# EAGLE design KGGR_wD (EAGLE 9.3.1)

## Sheet 1 of 2
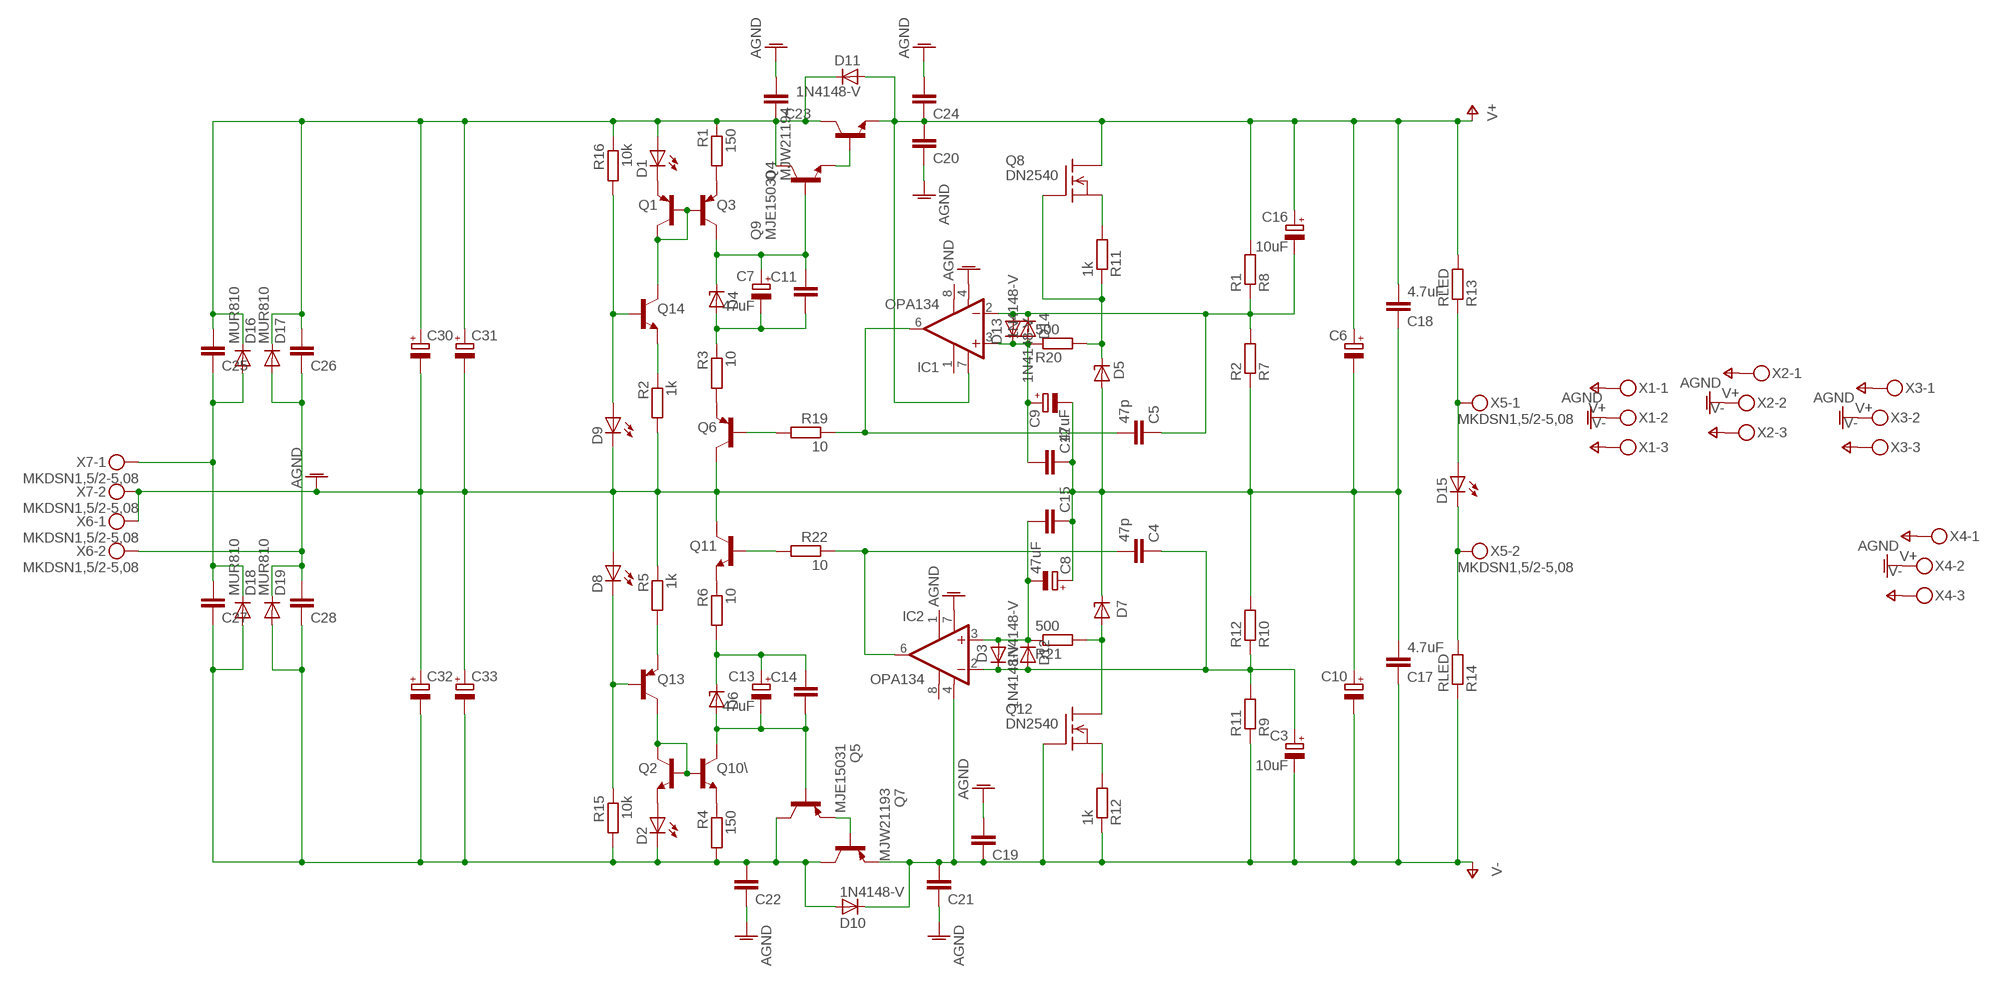
[diagram p0: schematic, sheet 1]

### Parts
C3  10uF  CPOL-EUE5-8.5  [E5-8,5]
C4  47p  C-EU025_050-025X075  [C025_050-025X075]
C5  47p  C-EU025_050-025X075  [C025_050-025X075]
C6  CPOL-EUE7.5-18  [E7,5-18]
C7  47uF  CPOL-EUE5-8.5  [E5-8,5]
C8  47uF  CPOL-EUE5-8.5  [E5-8,5]
C9  47uF  CPOL-EUE5-8.5  [E5-8,5]
C10  CPOL-EUE7.5-18  [E7,5-18]
C11  C-EU050-035X075  [C050-035X075]
C12  C-EU050-035X075  [C050-035X075]
C13  47uF  CPOL-EUE5-8.5  [E5-8,5]
C14  C-EU050-035X075  [C050-035X075]
C15  C-EU050-035X075  [C050-035X075]
C16  10uF  CPOL-EUE5-8.5  [E5-8,5]
C17  4.7uF  C-EU050-075X075  [C050-075X075]
C18  4.7uF  C-EU050-075X075  [C050-075X075]
C19  C-EU050-035X075  [C050-035X075]
C20  C-EU050-035X075  [C050-035X075]
C21  C-EU050-035X075  [C050-035X075]
C22  C-EU050-075X075  [C050-075X075]
C23  C-EU050-075X075  [C050-075X075]
C24  C-EU050-035X075  [C050-035X075]
C25  C-EU050-035X075  [C050-035X075]
C26  C-EU050-035X075  [C050-035X075]
C27  C-EU050-035X075  [C050-035X075]
C28  C-EU050-035X075  [C050-035X075]
C30  CPOL-EUE7.5-18  [E7,5-18]
C31  CPOL-EUE7.5-18  [E7,5-18]
C32  CPOL-EUE7.5-18  [E7,5-18]
C33  CPOL-EUE7.5-18  [E7,5-18]
D1  LED5MM  [LED5MM]
D2  LED5MM  [LED5MM]
D3  1N4148-V  [1N4148]
D4  1N4728  [DO41Z10]
D5  LT1021  LT1021-V  [DIL08]
D6  1N4728  [DO41Z10]
D7  LT1021  LT1021-V  [DIL08]
D8  LED5MM  [LED5MM]
D9  LED5MM  [LED5MM]
D10  1N4148-V  [1N4148]
D11  1N4148-V  [1N4148]
D12  1N4148-V  [1N4148]
D13  1N4148-V  [1N4148]
D14  1N4148-V  [1N4148]
D15  LED5MM  [LED5MM]
D16  MUR810  [TO220ACS]
D17  MUR810  [TO220ACS]
D18  MUR810  [TO220ACS]
D19  MUR810  [TO220ACS]
IC1  OPA134  OPA134P  [DIL08]
IC2  OPA134  OPA134P  [DIL08]
Q1  MPSA92-PNP-TO92-EBC  [TO92-EBC]
Q2  MPSA42-NPN-TO92-EBC  [TO92-EBC]
Q3  MPSA92-PNP-TO92-EBC  [TO92-EBC]
Q4  MJW21194  MJL4281  [TO-264]
Q5  MJE15031  [TO220KG]
Q6  MPSA92-PNP-TO92-EBC  [TO92-EBC]
Q7  MJW21193  MJL4302  [TO-264]
Q8  DN2540  2N7000  [TO92-]
Q9  MJE15030  [TO220KG]
Q10\  MPSA42-NPN-TO92-EBC  [TO92-EBC]
Q11  MPSA42-NPN-TO92-EBC  [TO92-EBC]
Q12  DN2540  2N7000  [TO92-]
Q13  MPSA92-PNP-TO92-EBC  [TO92-EBC]
Q14  MPSA42-NPN-TO92-EBC  [TO92-EBC]
R1  150  R-EU_0309/12  [0309/12]
R2  1k  R-EU_0309/12  [0309/12]
R3  10  R-EU_0309/12  [0309/12]
R4  150  R-EU_0309/12  [0309/12]
R5  1k  R-EU_0309/12  [0309/12]
R6  10  R-EU_0309/12  [0309/12]
R7  R2  R-EU_0309/12  [0309/12]
R8  R1  R-EU_0309/12  [0309/12]
R9  R11  R-EU_0309/12  [0309/12]
R10  R12  R-EU_0309/12  [0309/12]
R11  1k  R-EU_0309/12  [0309/12]
R12  1k  R-EU_0309/12  [0309/12]
R13  RLED  R-EU_0309/12  [0309/12]
R14  RLED  R-EU_0309/12  [0309/12]
R15  10k  R-EU_0309/12  [0309/12]
R16  10k  R-EU_0309/12  [0309/12]
R19  10  R-EU_0309/12  [0309/12]
R20  500  R-EU_0309/12  [0309/12]
R21  500  R-EU_0309/12  [0309/12]
R22  10  R-EU_0309/12  [0309/12]
X1  MKDSN1,5/3-5,08  [MKDSN1,5/3-5,08]
X2  MKDSN1,5/3-5,08  [MKDSN1,5/3-5,08]
X3  MKDSN1,5/3-5,08  [MKDSN1,5/3-5,08]
X4  MKDSN1,5/3-5,08  [MKDSN1,5/3-5,08]
X5  MKDSN1,5/2-5,08  [MKDSN1,5/2-5,08]
X6  MKDSN1,5/2-5,08  [MKDSN1,5/2-5,08]
X7  MKDSN1,5/2-5,08  [MKDSN1,5/2-5,08]

### Nets
AGND: C6.- C8.+ C9.- C10.+ C12.1 C15.1 C17.2 C18.1 C19.2 C20.1 C21.1 C22.1 C23.2 C24.2 C30.- C31.- C32.+ C33.+ D5.4(GND) D7.6(OUT) D8.A D9.K(C) IC1.4(V-) IC2.7(V+) Q6.C Q11.C R2.2 R5.1 R7.1 R10.2 X1.2 X2.2 X3.2 X4.2 X6.1 X7.2
N$1: Q1.B Q1.C Q3.B Q14.C
N$2: D1.K(C) Q1.E
N$3: Q3.E R1.2
N$4: C23.1 C25.2 C26.2 C30.+ C31.+ D1.A D11.C D16.C D17.C Q4.C Q9.2(C) R1.1 R16.1
N$5: C7.+ C11.1 D4.C Q3.C Q9.1(B)
N$6: C7.- C11.2 D4.A R3.1
N$7: Q6.E R3.2
N$8: Q14.E R2.1
N$9: D9.A Q14.B R16.2
N$10: C8.- C15.2 D3.A D12.C IC2.3(+IN) R21.1
N$11: Q13.E R5.2
N$12: D8.K(C) Q13.B R15.1
N$13: Q11.E R6.1
N$14: C13.+ C14.1 D6.C R6.2
N$15: C13.- C14.2 D6.A Q5.1(B) Q10\.C
N$16: Q2.B Q2.C Q10\.B Q13.C
N$17: Q5.3(E) Q7.B
N$18: Q10\.E R4.1
N$19: D2.A Q2.E
N$21: Q4.B Q9.3(E)
N$22: C22.2 C27.1 C28.1 C32.- C33.- D2.K(C) D10.A D18.A D19.A Q5.2(C) Q7.C R4.2 R15.2
N$23: C25.1 C27.2 D16.A D18.C X7.1
N$24: C5.2 C5.3 IC1.6(OUT) R19.1
N$25: C4.2 C4.3 IC2.6(OUT) R22.1
N$26: Q11.B R22.2
N$27: Q6.B R19.2
N$28: C5.1 C16.- D13.A D14.C IC1.2(-IN) R7.2 R8.1
N$29: Q12.3(S) R12.2
N$30: D5.6(OUT) Q8.2(G) R11.1 R20.2
N$31: C9.+ C12.2 D13.C D14.A IC1.3(+IN) R20.1
N$32: D15.K(C) R14.2 X5.2
N$33: D7.4(GND) Q12.1(D) R21.2
N$34: C3.+ C4.1 D3.C D12.A IC2.2(-IN) R9.2 R10.1
N$35: Q8.3(S) R11.2
N$36: D15.A R13.1 X5.1
N$38: C26.1 C28.2 D17.A D19.C X6.2
V+: C6.+ C16.+ C18.2 C20.2 C24.1 D11.A IC1.7(V+) Q4.E Q8.1(D) R8.2 R13.2 X1.1 X2.1 X3.1 X4.1
V-: C3.- C10.- C17.1 C19.1 C21.2 D10.C IC2.4(V-) Q7.E Q12.2(G) R9.1 R12.1 R14.1 X1.3 X2.3 X3.3 X4.3
Unconnected: IC1.1(TRIM1) IC1.8(TRIM2) IC2.1(TRIM1) IC2.8(TRIM2)

## Sheet 2 of 2
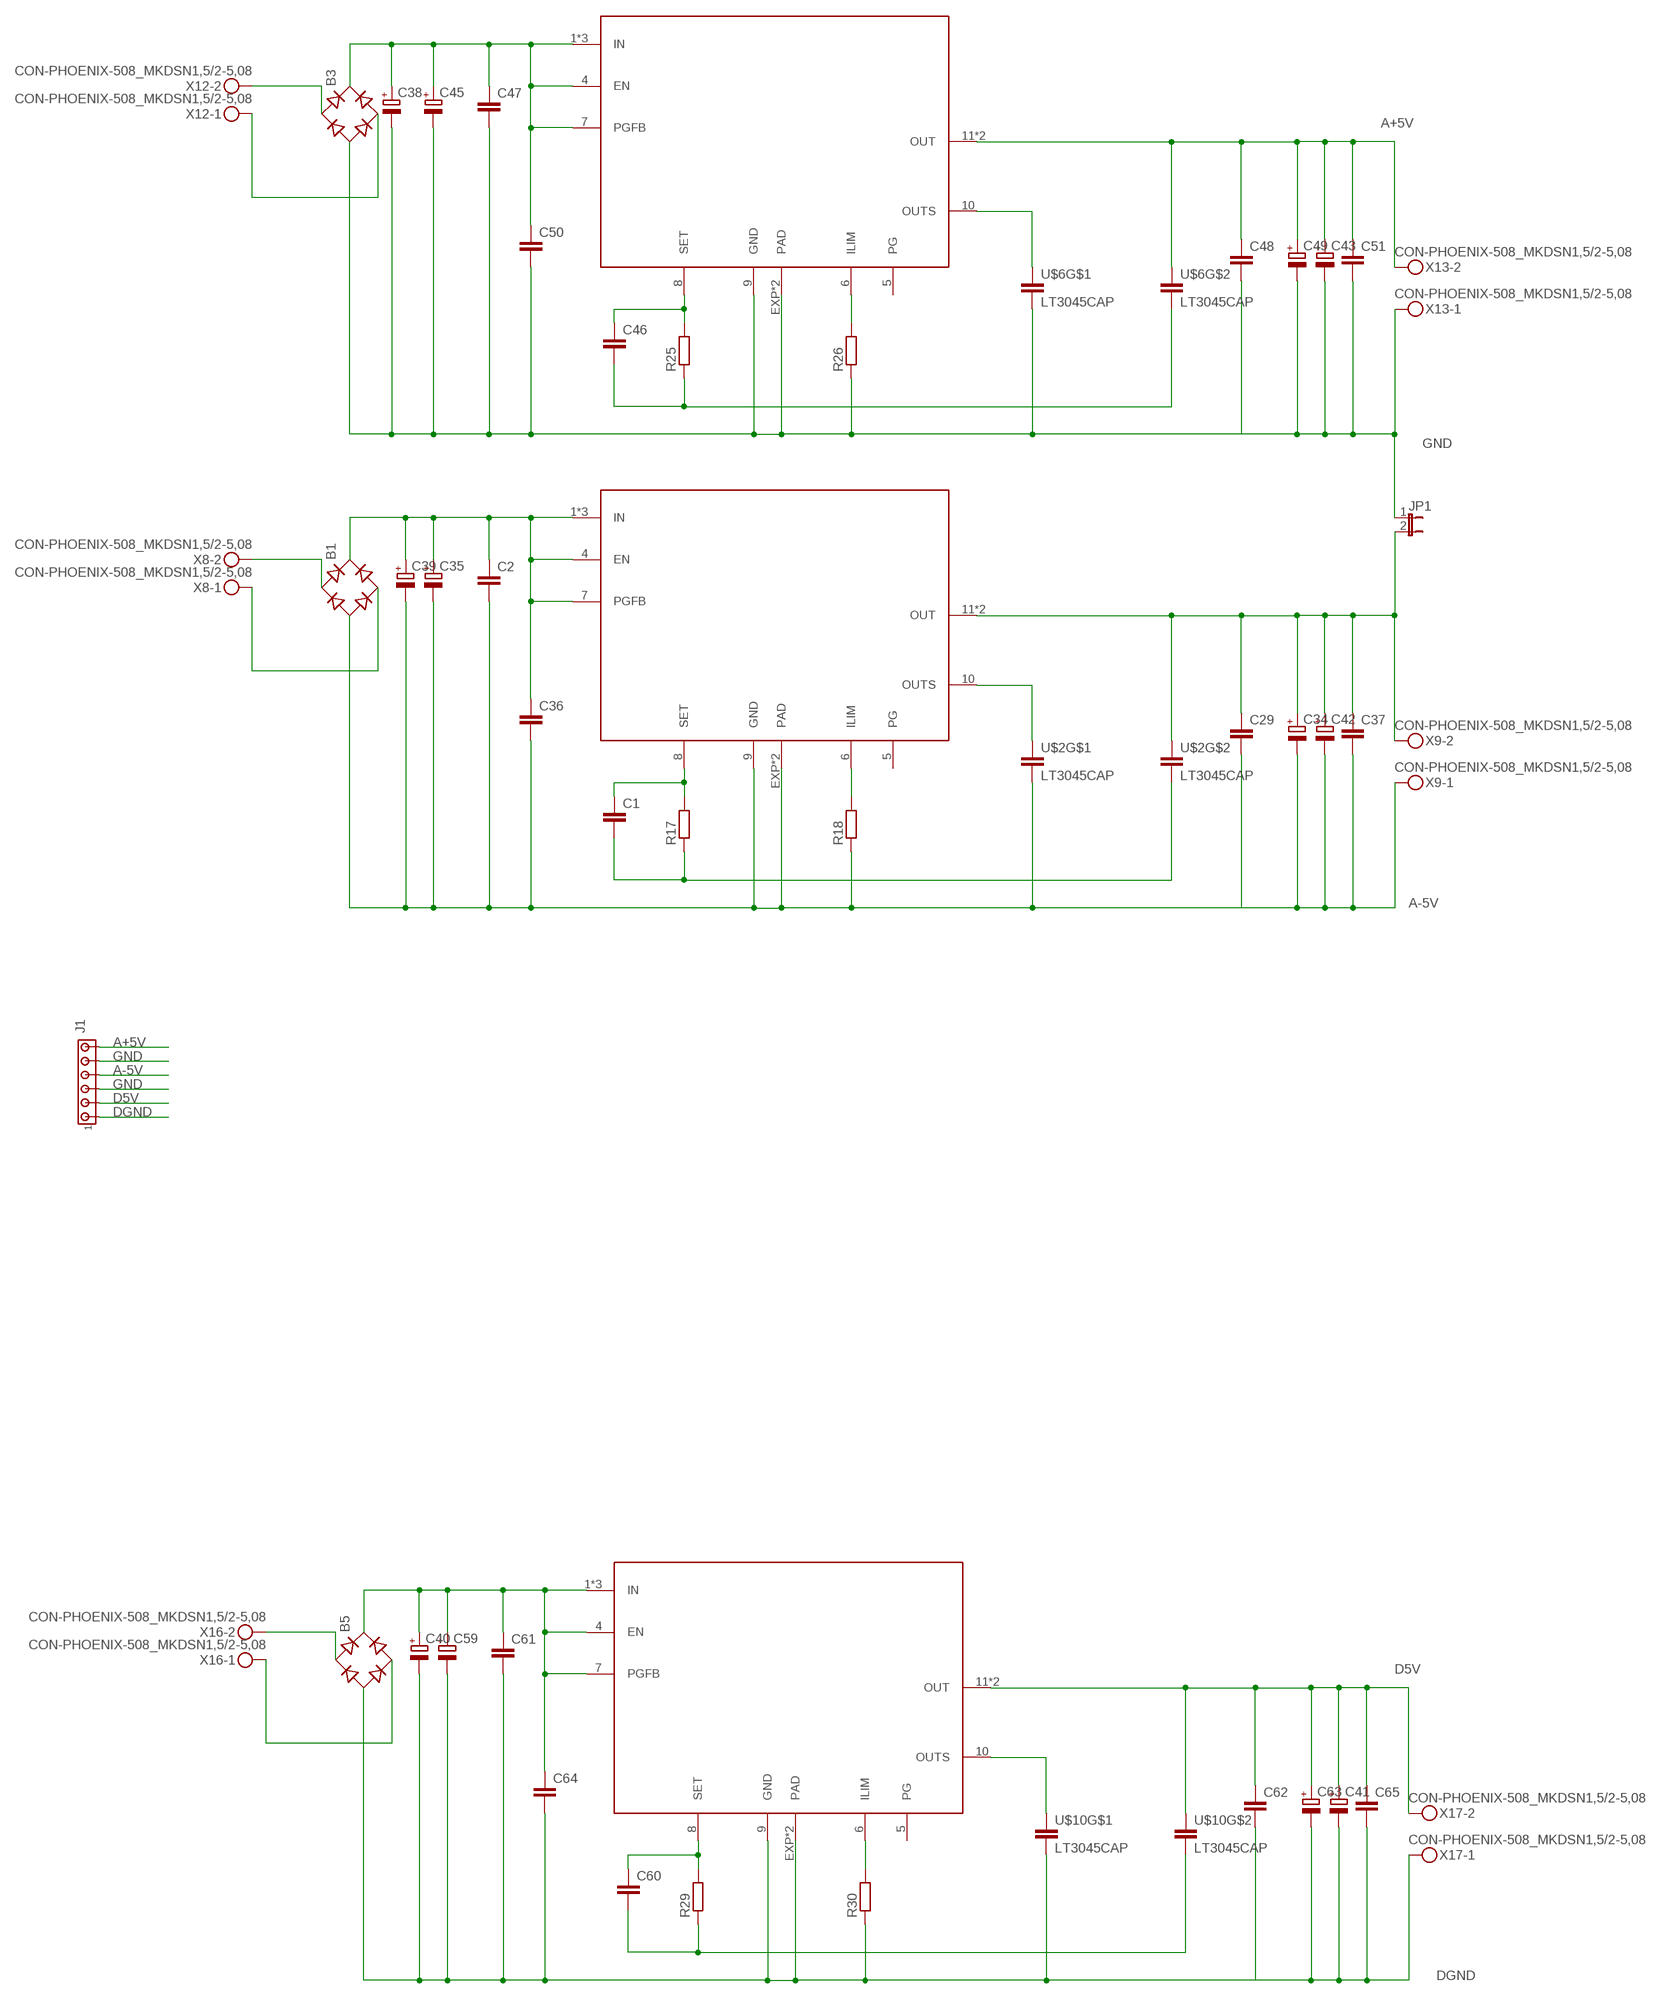
[diagram p1: schematic, sheet 2]

### Parts
B1  RB1A  [RB1A]
B3  RB1A  [RB1A]
B5  RB1A  [RB1A]
C1  C-EUC1206  [C1206]
C2  C-EU050-050X075  [C050-050X075]
C29  C-EU050-050X075  [C050-050X075]
C34  CPOL-EUE5-10.5  [E5-10,5]
C35  CPOL-EUE7.5-18  [E7,5-18]
C36  C-EUC1206  [C1206]
C37  C-EUC1206  [C1206]
C38  CPOL-EUSP-CAP-CX  [SP-CAP-CX]
C39  CPOL-EUSP-CAP-CX  [SP-CAP-CX]
C40  CPOL-EUSP-CAP-CX  [SP-CAP-CX]
C41  CPOL-EUSP-CAP-CX  [SP-CAP-CX]
C42  CPOL-EUSP-CAP-CX  [SP-CAP-CX]
C43  CPOL-EUSP-CAP-CX  [SP-CAP-CX]
C45  CPOL-EUE7.5-18  [E7,5-18]
C46  C-EUC1206  [C1206]
C47  C-EU050-050X075  [C050-050X075]
C48  C-EU050-050X075  [C050-050X075]
C49  CPOL-EUE5-10.5  [E5-10,5]
C50  C-EUC1206  [C1206]
C51  C-EUC1206  [C1206]
C59  CPOL-EUE7.5-18  [E7,5-18]
C60  C-EUC1206  [C1206]
C61  C-EU050-050X075  [C050-050X075]
C62  C-EU050-050X075  [C050-050X075]
C63  CPOL-EUE5-10.5  [E5-10,5]
C64  C-EUC1206  [C1206]
C65  C-EUC1206  [C1206]
J1  MTA06-156  [1X6MTA]
JP1  JP1E  [JP1]
R17  R-EU_MELF0204R  [MINI_MELF-0204R]
R18  R-EU_MELF0204R  [MINI_MELF-0204R]
R25  R-EU_MELF0204R  [MINI_MELF-0204R]
R26  R-EU_MELF0204R  [MINI_MELF-0204R]
R29  R-EU_MELF0204R  [MINI_MELF-0204R]
R30  R-EU_MELF0204R  [MINI_MELF-0204R]
U$1  LT3045  [MSOP12]
U$2  LT3045CAP  [LT3045CAP]
U$5  LT3045  [MSOP12]
U$6  LT3045CAP  [LT3045CAP]
U$9  LT3045  [MSOP12]
U$10  LT3045CAP  [LT3045CAP]
X8  CON-PHOENIX-508_MKDSN1,5/2-5,08  [CON-PHOENIX-508_MKDSN1,5/2-5,08]
X9  CON-PHOENIX-508_MKDSN1,5/2-5,08  [CON-PHOENIX-508_MKDSN1,5/2-5,08]
X12  CON-PHOENIX-508_MKDSN1,5/2-5,08  [CON-PHOENIX-508_MKDSN1,5/2-5,08]
X13  CON-PHOENIX-508_MKDSN1,5/2-5,08  [CON-PHOENIX-508_MKDSN1,5/2-5,08]
X16  CON-PHOENIX-508_MKDSN1,5/2-5,08  [CON-PHOENIX-508_MKDSN1,5/2-5,08]
X17  CON-PHOENIX-508_MKDSN1,5/2-5,08  [CON-PHOENIX-508_MKDSN1,5/2-5,08]

### Nets
A+5V: C43.+ C48.1 C49.+ C51.1 J1.6 U$5.11(OUT) U$5.12(OUT) U$6.4 X13.2
A-5V: B1.- C2.2 C29.2 C34.- C35.- C36.2 C37.2 C39.- C42.- J1.4 R18.1 U$1.9(GND) U$1.EXP1(PAD) U$1.EXP(PAD) U$2.5 X9.1
D5V: C41.+ C62.1 C63.+ C65.1 J1.2 U$9.11(OUT) U$9.12(OUT) U$10.4 X17.2
DGND: B5.- C40.- C41.- C59.- C61.2 C62.2 C63.- C64.2 C65.2 J1.1 R30.1 U$9.9(GND) U$9.EXP1(PAD) U$9.EXP(PAD) U$10.5 X17.1
GND: B3.- C38.- C43.- C45.- C47.2 C48.2 C49.- C50.2 C51.2 J1.3 J1.5 JP1.1 R26.1 U$5.9(GND) U$5.EXP1(PAD) U$5.EXP(PAD) U$6.5 X13.1
IN1: B1.+ C2.1 C35.+ C36.1 C39.+ U$1.1(IN) U$1.2(IN) U$1.3(IN) U$1.4(EN) U$1.7(PGFB)
IN2: B3.+ C38.+ C45.+ C47.1 C50.1 U$5.1(IN) U$5.2(IN) U$5.3(IN) U$5.4(EN) U$5.7(PGFB)
IN3: B5.+ C40.+ C59.+ C61.1 C64.1 U$9.1(IN) U$9.2(IN) U$9.3(IN) U$9.4(EN) U$9.7(PGFB)
N$44: U$1.10(OUTS) U$2.3
N$46: U$5.10(OUTS) U$6.3
N$47: R18.2 U$1.6(ILIM)
N$48: B1.AC2 X8.1
N$49: B1.AC1 X8.2
N$50: R26.2 U$5.6(ILIM)
N$51: B3.AC2 X12.1
N$52: B3.AC1 X12.2
N$57: U$9.10(OUTS) U$10.3
N$58: R30.2 U$9.6(ILIM)
N$59: B5.AC2 X16.1
N$60: B5.AC1 X16.2
OUT1: C29.1 C34.+ C37.1 C42.+ JP1.2 U$1.11(OUT) U$1.12(OUT) U$2.4 X9.2
SET1: C1.1 R17.2 U$1.8(SET)
SET2: C46.1 R25.2 U$5.8(SET)
SET3: C60.1 R29.2 U$9.8(SET)
SGND1: C1.2 R17.1 U$2.6
SGND2: C46.2 R25.1 U$6.6
SGND3: C60.2 R29.1 U$10.6
Unconnected: U$1.5(PG) U$5.5(PG) U$9.5(PG)

## Library data of the parts
B1 B3 B5 = rectifier:RB1A: RECTIFIER 1 A
C1 C2 C4 C5 C11 C12 C14 C15 C17-C29 C36 C37 C46-C48 C50 C51 C60-C62 C64 C65 = Vwvwbg:C-EU: CAPACITOR, European symbol
C3 C6-C10 C13 C16 C30-C35 C38-C43 C45 C49 C59 C63 = Vwvwbg:CPOL-EU: POLARIZED CAPACITOR, European symbol
D1 D2 D8 D9 D15 = led:LED: LED OSRAM: - CHIPLED LG R971, LG N971, LY N971, LG Q971, LY Q971, LO R971, LY R971 LH N974, LH R974 LS Q976, LO Q976, LY Q976 LO Q996 - Hyper CHIPLED LW Q18S LB Q993, LB Q99A, LB R99A - SideLED LS A670, LO A670, LY A670, LG A670, LP A670 LB A673, LV A673, LT A673, LW A673 LH A674 LY A675 LS A676, LA A676, LO A676, LY A676, LW A676 LS A679, LY A679, LG A679 - Hyper Micro SIDELED® LS Y876, LA Y876, LO Y876, LY Y876 LT Y87S - SmartLED LW L88C, LW L88S LB L89C, LB L89S, LG L890 LS L89K, LO L89K, LY L89K LS L896, LA L896, LO L896, LY L896 - TOPLED LS T670, LO T670, LY T670, LG T670, LP T670 LSG T670, LSP T670, LSY T670, LOP T670, LYG T670 LG T671, LOG T671, LSG T671 LB T673, LV T673, LT T673, LW T673 LH T674 LS T676, LA T676, LO T676, LY T676, LB T676, LH T676, LSB T676, LW T676 LB T67C, LV T67C, LT T67C, LS T67K, LO T67K, LY T67K, LW E67C LS E67B, LA E67B, LO E67B, LY E67B, LB E67C, LV E67C, LT E67C LW T67C LS T679, LY T679, LG T679 LS T770, LO T770, LY T770, LG T770, LP T770 LB T773, LV T773, LT T773, LW T773 LH T774 LS E675, LA E675, LY E675, LS T675 LS T776, LA T776, LO T776, LY T776, LB T776 LHGB T686 LT T68C, LB T68C - Hyper Mini TOPLED® LB M676 - Mini TOPLED Santana® LG M470 LS M47K, LO M47K, LY M47K Source: http://www.osram.convergy.de LUXEON: - LUMILED® LXK2-PW12-R00, LXK2-PW12-S00, LXK2-PW14-U00, LXK2-PW14-V00 LXK2-PM12-R00, LXK2-PM12-S00, LXK2-PM14-U00 LXK2-PE12-Q00, LXK2-PE12-R00, LXK2-PE12-S00, LXK2-PE14-T00, LXK2-PE14-U00 LXK2-PB12-K00, LXK2-PB12-L00, LXK2-PB12-M00, LXK2-PB14-N00, LXK2-PB14-P00, LXK2-PB14-Q00 LXK2-PR12-L00, LXK2-PR12-M00, LXK2-PR14-Q00, LXK2-PR14-R00 LXK2-PD12-Q00, LXK2-PD12-R00, LXK2-PD12-S00 LXK2-PH12-R00, LXK2-PH12-S00 LXK2-PL12-P00, LXK2-PL12-Q00, LXK2-PL12-R00 Source: www.luxeon.com KINGBRIGHT: KA-3528ASYC Source: www.kingbright.com
D3 D10-D14 = diode:1N4148-V
D4 D6 = diode:1N4728: Z DIODE 3.3 V, 1W, 5 percent
D5 D7 = linear-technology:LT1021-V
D16-D19 = diode:MUR810: DIODE
IC1 IC2 = burr-brown:OPA134: Operational Amplifiers SoundPlus(TM) High Performance Audio; MF: TEXAS INSTRUMENTS; MPN: OPA134PA; OC_FARNELL: 1335032; OC_NEWARK: 75C4599
J1 = con-amp:MTA06-156: AMP connector
JP1 = jumper:JP1E: JUMPER
Q1 Q3 Q6 Q13 = transistor:*-PNP-: PNP Transistror
Q2 Q10\ Q11 Q14 = transistor:*-NPN-: NPN Transistror BF959 corrected 2008.03.06
Q4 = TO264:MJL4281: MJL4281 NPN BCE TO-264
Q5 = transistor:MJE15031
Q7 = TO264:MJL4302: MJL4302 PNP BCE TO-264
Q8 Q12 = tranzistory FET:2N7000
Q9 = transistor:MJE15030
R1-R22 R25 R26 R29 R30 = Vwvwbg:R-EU_: RESISTOR, European symbol
U$1 U$5 U$9 = Vwvwbg:LT3045
U$2 U$6 U$10 = Vwvwbg:LT3045CAP
X1-X4 = con-phoenix-508:MKDSN1,5/3-5,08: MKDSN 1,5/ 3-5,08 Printklemme Nennstrom: 13,5 A Nennspannung: 250 V Rastermaß: 5,08 mm Polzahl: 3 Anschlussart: Schraubanschluss Montage: Löten Anschlussrichtung Leiter/Platine: 0 ° Artikelnummer: 1729131 Source: http://eshop.phoenixcontact.com .. 1729131.pdf
X5-X7 = con-phoenix-508:MKDSN1,5/2-5,08: MKDSN 1,5/ 2-5,08 Printklemme Nennstrom: 13,5 A Nennspannung: 250 V Rastermaß: 5,08 mm Polzahl: 2 Anschlussart: Schraubanschluss Montage: Löten Anschlussrichtung Leiter/Platine: 0 ° Artikelnummer: 1729128 Source: http://eshop.phoenixcontact.com .. 1729128.pdf
X8 X9 X12 X13 X16 X17 = Vwvwbg:CON-PHOENIX-508_MKDSN1,5/2-5,08: MKDSN 1,5/ 2-5,08 Printklemme Nennstrom: 13,5 A Nennspannung: 250 V Rastermaß: 5,08 mm Polzahl: 2 Anschlussart: Schraubanschluss Montage: Löten Anschlussrichtung Leiter/Platine: 0 ° Artikelnummer: 1729128 Source: http://eshop.phoenixcontact.com .. 1729128.pdf

## Board
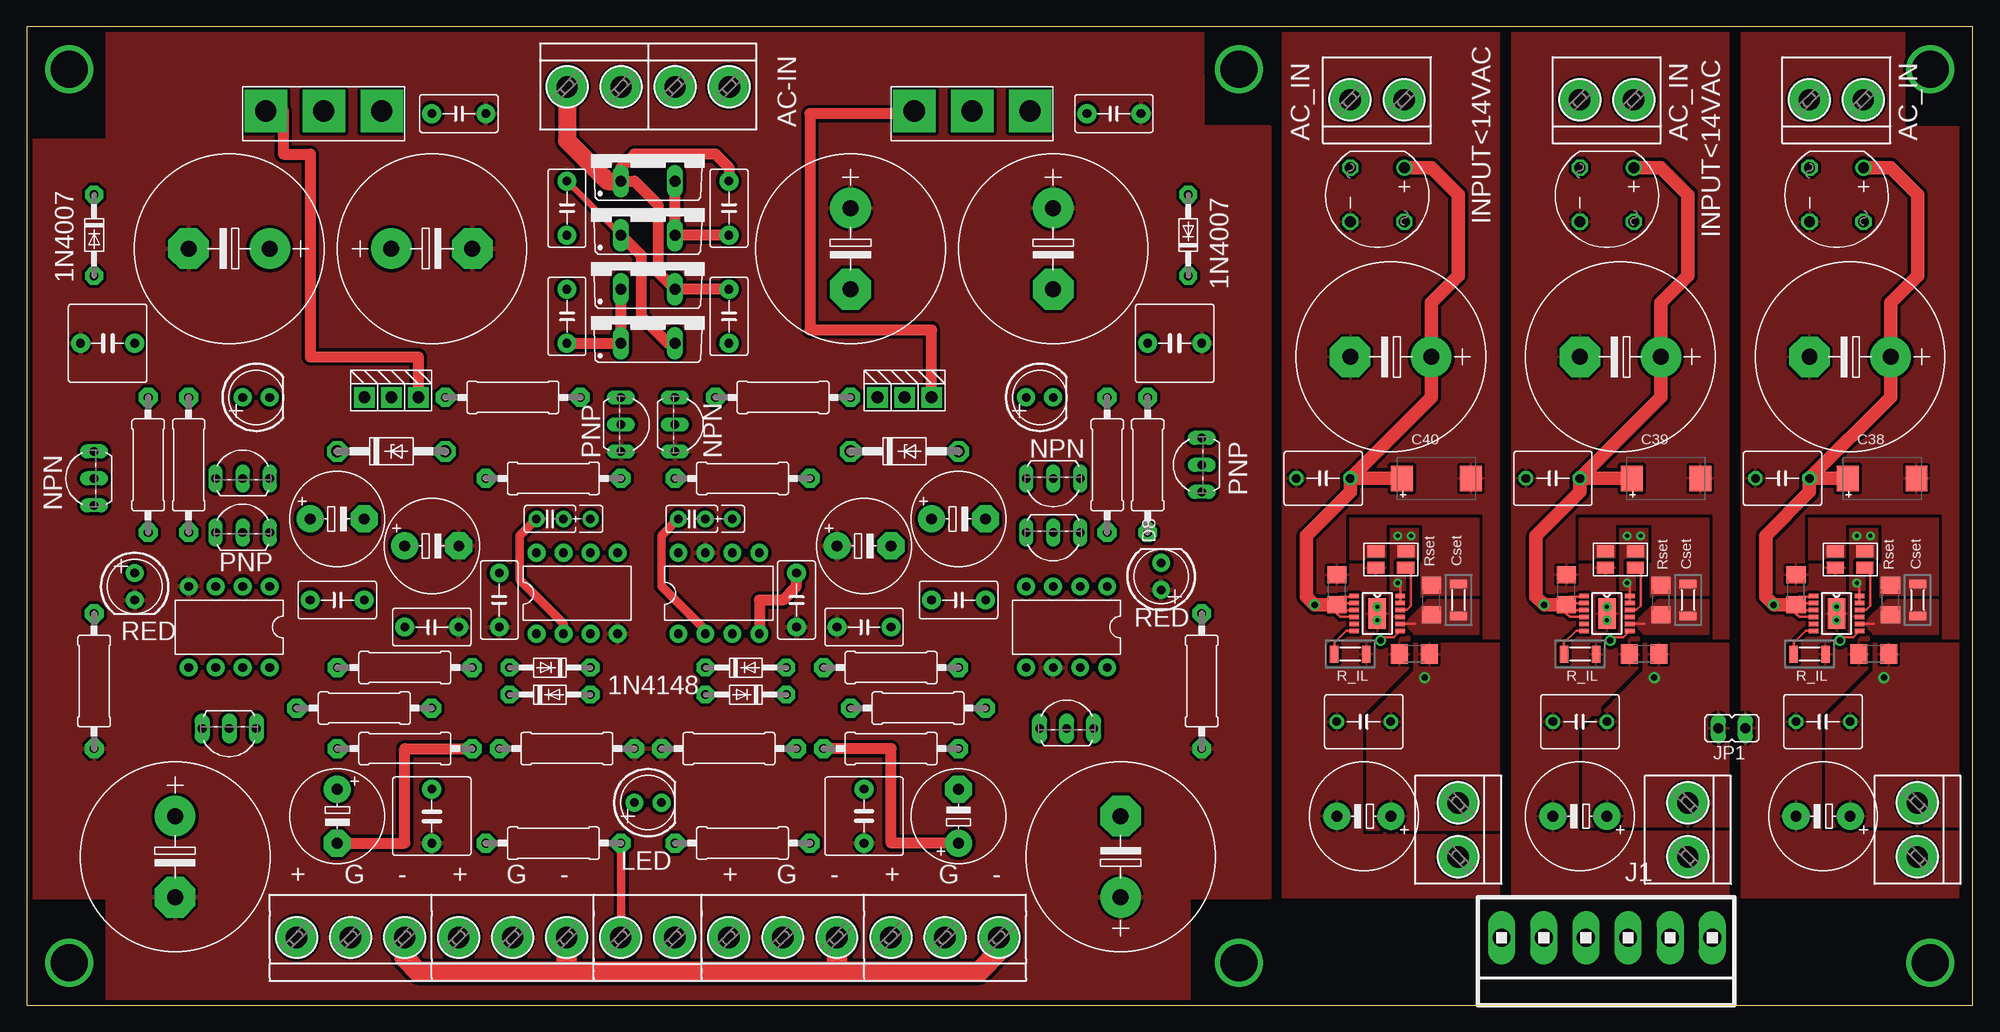
[diagram p2: board, top side]
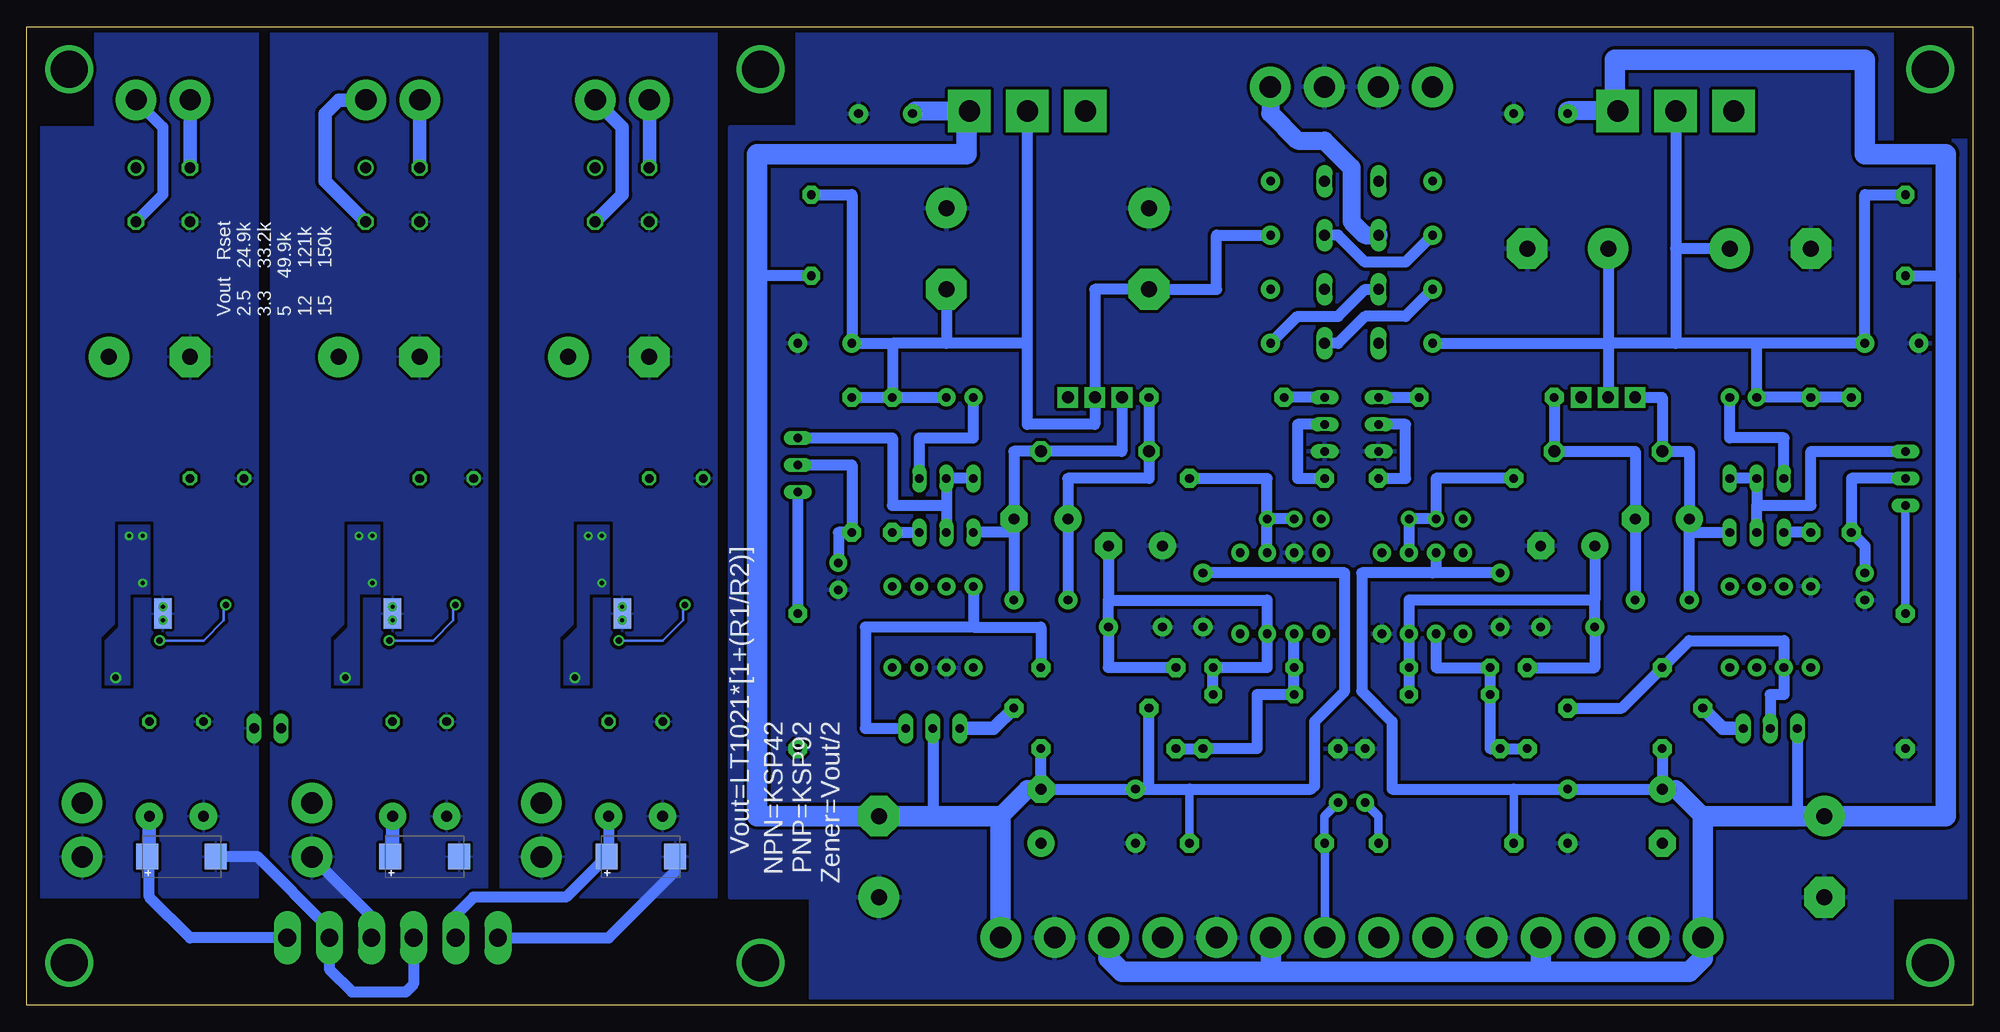
[diagram p3: board, bottom side, seen from below]

Size 183 x 92 mm. Coordinates in mm from the lower left corner, seen from the top.
Outline: 0,0 183,0 183,92 0,92 0,0
Copper layers (1*16): Top 0.035mm / dielectric 1.5mm / Bottom 0.035mm
Design rules "default *": minimum track width 10mil, minimum drill 24mil, track to track 12mil, track to pad 12mil, pad to pad 8mil, via to via 8mil, smd to smd 8mil, copper to edge 20mil, drill to drill 8mil, minimum pad ring 10mil, minimum via ring 8mil, stop-mask expansion 4mil, vias tented up to drill 0mil, thermal gap 10mil

### Footprints (pad centres in the part's own frame; a part is rotated, then mirrored left to right if it is on the bottom)
RB1A = drill 1.016: + -2.54,2.54 | drill 1.016 octagon: - 2.54,-2.54; AC1 2.54,2.54; AC2 -2.54,-2.54
C1206 = smd 1.6 x 1.8: 1 -1.4,0; 2 1.4,0
C050-050X075 = drill 0.813 octagon: 1 -2.54,0; 2 2.54,0
E5-8,5 = drill 1.016 pad 2.54: + -2.54,0 | drill 1.016 pad 2.54 octagon: - 2.54,0
C025_050-025X075 = drill 0.813 pad 1.524: 1 -1.27,0; 2 1.27,0; 3 3.81,0
E7,5-18 = drill 1.5 pad 3.81: + -3.81,0 | drill 1.5 pad 3.81 octagon: - 3.81,0
C050-035X075 = drill 0.813 pad 1.778: 1 -2.54,0; 2 2.54,0
C050-075X075 = drill 0.813 pad 1.778: 1 -2.54,0; 2 2.54,0
E5-10,5 = drill 1.016 pad 2.54: + -2.54,0; - 2.54,0
SP-CAP-CX = smd 2.062 x 2.4: + -2.754,0; - 3.707,0
LED5MM = drill 0.813 pad 1.676: A -1.27,0; K 1.27,0
1N4148 = drill 0.813 pad 1.676 octagon: A 3.81,0; C -3.81,0
DO41Z10 = drill 1.118 pad 1.93 octagon: A 5.08,0; C -5.08,0
DIL08 = drill 0.813 pad 1.676: 1 -3.81,-3.81; 2 -1.27,-3.81; 3 1.27,-3.81; 4 3.81,-3.81; 5 3.81,3.81; 6 1.27,3.81; 7 -1.27,3.81; 8 -3.81,3.81
TO220ACS = drill 1.016 long: A 2.54,-2.54; C -2.54,-2.54
1X6MTA = drill 1.676 long: 1 9.906,0; 2 5.944,0; 3 1.981,0; 4 -1.981,0; 5 -5.944,0; 6 -9.906,0
JP1 = drill 0.914 long: 1 0,-1.27; 2 0,1.27
TO92-EBC = drill 0.813 long: B 0,-1.27; C 2.54,-1.27; E -2.54,-1.27
TO-264 = drill 2 pad 4 square: B -5.45,-6.096; C 0,-6.096; E 5.45,-6.096
TO220KG = drill 1.1 pad 1.93 square: 1 -2.54,0; 2 0,0; 3 2.54,0
TO92- = drill 0.813 pad 1.422 long: 1 2.54,0; 2 0,0; 3 -2.54,0
0309/12 = drill 0.813 pad 1.778 octagon: 1 -6.35,0; 2 6.35,0
MINI_MELF-0204R = smd 0.8 x 1.6: 1 -1.5,0; 2 1.5,0
MSOP12 = smd 0.9 x 0.42: 1 -2.163,1.625; 2 -2.163,0.975; 3 -2.163,0.325; 4 -2.163,-0.325; 5 -2.163,-0.975; 6 -2.163,-1.625; 7 2.15,-1.625; 8 2.15,-0.975; 9 2.15,-0.325; 10 2.15,0.325; 11 2.15,0.975; 12 2.15,1.625 | smd 1.65 x 2.85: EXP 0,0 | smd 1.65 x 2.85 bottom: EXP1 0,0
LT3045CAP = smd 1.6 x 1.143: 3 -1.394,0.767; 4 -1.4,-0.776; 5 1.402,0.776; 6 1.403,-0.767
MKDSN1,5/3-5,08 = drill 2 pad 3.81: 1 -7.641,0.025; 2 -2.561,0.025; 3 2.519,0.025
MKDSN1,5/2-5,08 = drill 2 pad 3.81: 1 -2.561,0.025; 2 2.519,0.025
CON-PHOENIX-508_MKDSN1,5/2-5,08 = drill 2 pad 3.81: 1 -2.561,0.025; 2 2.519,0.025

### Placement (x,y rotation side)
B1  148.59,76.2 270 top
B3  170.18,76.2 270 top
B5  127,76.2 270 top
C1  153.67,38.1 90 top
C2  143.51,49.53 180 top
C3  87.63,17.78 90 top
C4  62.55,45.72 0 top
C5  49.21,45.72 0 top
C6  13.97,13.97 270 top
C7  29.21,45.72 0 top
C8  78.74,43.18 0 top
C9  38.1,43.18 0 top
C10  102.87,13.97 90 top
C11  29.21,38.1 0 top
C12  38.1,35.56 180 top
C13  87.63,45.72 0 top
C14  87.63,38.1 0 top
C15  78.74,35.56 0 top
C16  29.21,17.78 270 top
C17  78.74,17.78 270 top
C18  38.1,17.78 90 top
C19  72.39,38.1 270 top
C20  44.45,38.1 90 top
C21  102.23,83.82 180 top
C22  107.95,62.23 180 top
C23  7.62,62.23 180 top
C24  40.64,83.82 0 top
C25  50.8,64.77 270 top
C26  66.04,64.77 270 top
C27  50.8,74.93 90 top
C28  66.04,74.93 90 top
C29  146.05,26.67 180 top
C30  19.05,71.12 180 top
C31  38.1,71.12 0 top
C32  77.47,71.12 270 top
C33  96.52,71.12 270 top
C34  146.05,17.78 180 top
C35  149.86,60.96 180 top
C36  144.78,39.05 90 top
C37  152.08,33.02 180 top
C38  173.99,49.53 0 top
C39  153.67,49.53 0 top
C40  132.08,49.53 0 top
C41  125.73,13.97 0 bottom
C42  146.05,13.97 0 bottom
C43  168.91,13.97 0 bottom
C45  171.45,60.96 180 top
C46  175.26,38.1 90 top
C47  165.1,49.53 180 top
C48  168.91,26.67 180 top
C49  168.91,17.78 180 top
C50  166.37,39.05 90 top
C51  173.67,33.02 180 top
C59  128.27,60.96 180 top
C60  132.08,38.1 90 top
C61  121.92,49.53 180 top
C62  125.73,26.67 180 top
C63  125.73,17.78 180 top
C64  123.19,39.05 90 top
C65  130.49,33.02 180 top
D1  21.59,57.15 0 top
D2  95.25,57.15 0 top
D3  67.63,31.75 0 top
D4  34.29,52.07 0 top
D5  19.05,35.56 180 top
D6  82.55,52.07 0 top
D7  97.79,35.56 180 top
D8  106.68,40.32 90 top
D9  10.16,39.37 270 top
D10  109.22,72.39 90 top
D11  6.35,72.39 270 top
D12  67.63,29.21 180 top
D13  49.21,31.75 180 top
D14  49.21,29.21 0 top
D15  58.42,19.05 0 top
D16  58.42,64.77 0 top
D17  58.42,69.85 0 top
D18  58.42,74.93 0 top
D19  58.42,80.01 0 top
IC1  51.75,38.73 0 top
IC2  65.09,38.73 0 top
J1  148.59,6.35 180 top
JP1  160.34,26.04 90 top
Q1  20.32,50.8 0 top
Q2  96.52,48.26 180 top
Q3  20.32,45.72 0 top
Q4  27.94,90.17 0 top
Q5  82.55,57.15 0 top
Q6  57.15,54.61 270 top
Q7  88.9,90.17 0 top
Q8  19.05,26.04 180 top
Q9  34.29,57.15 0 top
Q10\  96.52,43.18 180 top
Q11  62.23,54.61 270 top
Q12  97.79,26.04 0 top
Q13  109.22,50.8 90 top
Q14  5.08,49.53 90 top
R1  15.24,50.8 270 top
R2  6.35,30.48 270 top
R3  45.72,57.15 0 top
R4  101.6,50.8 90 top
R5  110.49,30.48 90 top
R6  71.12,57.15 0 top
R7  50.8,24.13 180 top
R8  35.56,24.13 180 top
R9  81.28,24.13 180 top
R10  66.04,24.13 180 top
R11  31.75,27.94 180 top
R12  83.82,27.94 0 top
R13  49.53,15.24 180 top
R14  67.31,15.24 180 top
R15  105.41,50.8 90 top
R16  11.43,50.8 270 top
R17  156.21,38.1 270 top
R18  146.05,33.02 180 top
R19  49.53,49.53 0 top
R20  35.56,31.75 180 top
R21  81.28,31.75 0 top
R22  67.31,49.53 180 top
R25  177.8,38.1 270 top
R26  167.64,33.02 180 top
R29  134.62,38.1 270 top
R30  124.46,33.02 180 top
U$1  148.59,36.83 0 top
U$2  149.86,41.91 180 top
U$5  170.18,36.83 0 top
U$6  171.45,41.91 180 top
U$9  127,36.83 0 top
U$10  128.27,41.91 180 top
X1  88.9,6.35 0 top
X2  73.66,6.35 0 top
X3  48.26,6.35 0 top
X4  33.02,6.35 0 top
X5  58.42,6.35 0 top
X6  53.34,86.36 180 top
X7  63.5,86.36 180 top
X8  148.59,85.09 0 top
X9  156.21,16.51 90 top
X12  170.18,85.09 0 top
X13  177.8,16.51 90 top
X16  127,85.09 0 top
X17  134.62,16.51 90 top

### Tracks (layer width: path | path; a pad name or v marks a point on that pad's centre or on a via)
A+5V  (via drill 0.4, 0.61)
  Top 0.254: U$5.11 U$5.12 172.33,39.44 v172.09,39.69
  Bottom 1.016: J1.6 167.64,6.35 171.45,10.16 171.45,14.18
  Bottom 1.27: C49.+ 171.45,14.18 C43.+
  other vias: 173.35,44.13 172.09,44.13 174.62,30.8
  pour Top (no thermals): 171.45,39.05 171.45,44.77 173.99,44.77 173.99,39.05
  pour Bottom: 171.45,45.09 174.31,45.09 174.31,35.56 175.58,34.29 175.58,30.16 173.35,30.16 173.35,38.73 171.45,38.73
  pour Top: 173.67,33.97 173.67,31.43 169.23,26.99 169.23,16.83 181.61,16.83 181.61,33.97
A-5V  (via drill 0.4)
  Bottom 1.016: J1.4 150.57,8.34 X9.1
  other vias: 148.59,37.47 148.59,36.2
  pour Top (rank 3): 139.7,92.71 139.7,10.16 160.02,10.16 160.02,92.71
  pour Bottom (rank 2): 139.7,92.71 139.7,10.16 160.02,10.16 160.02,92.71
AGND
  pour Top: 7.62,92.71 110.49,92.71 110.54,82.55 116.84,82.55 116.84,10.16 109.22,10.16 109.22,0 7.62,0 7.62,10.16 -1.27,10.16 -1.27,81.28 7.62,81.28
  pour Bottom: -1.27,81.28 7.62,81.28 7.62,92.71 110.49,92.71 110.49,82.55 116.84,82.55 116.84,10.16 109.22,10.16 109.22,0 7.62,0 7.62,10.16 -1.27,10.16
D5V  (via drill 0.4, 0.61)
  Top 0.254: U$9.11 U$9.12 129.15,39.44 v128.91,39.69
  Bottom 1.016: C63.+ 128.27,14.18 C41.+ 132.29,10.16 140.97,10.16 142.65,8.48 J1.2
  other vias: 130.18,44.13 128.91,44.13 131.44,30.8
  pour Top (no thermals): 128.27,39.05 128.27,44.77 130.81,44.77 130.81,39.05
  pour Bottom: 128.27,45.09 131.13,45.09 131.13,35.56 132.4,34.29 132.4,30.16 130.18,30.16 130.18,38.73 128.27,38.73
  pour Top: 130.49,33.97 130.49,31.43 126.05,26.99 126.05,16.51 138.43,16.51 138.43,33.97
DGND  (via drill 0.4)
  Bottom 1.016: J1.1 128.27,6.35 122.02,12.6 C41.-
  other vias: 127,37.47 127,36.2
  pour Top (rank 3): 118.11,92.71 118.11,10.16 138.43,10.16 138.43,92.71
  pour Bottom (rank 2): 118.11,92.71 118.11,10.16 138.43,10.16 138.43,92.71
GND  (via drill 0.4)
  Bottom 1.016: J1.3 146.61,1.98 147.32,1.27 152.4,1.27 154.53,3.4 J1.5 154.53,7.21 161.29,13.97 C43.-
  other vias: 170.18,37.47 170.18,36.2
  pour Top (rank 3): 161.29,92.71 161.29,10.16 181.61,10.16 181.61,82.55 176.53,82.55 176.53,92.71
  pour Bottom (rank 2): 161.29,92.71 161.29,10.16 181.61,10.16 181.61,82.55 176.53,82.55 176.53,92.71
IN1  (via drill 0.61)
  Top 0.254: U$1.1 146.39,38.42 145.1,38.42 145.1,37.97 145,37.88 | 145,37.88 C36.1 145.28,37.16 U$1.3 | U$1.2 145.07,37.8 145,37.88 | U$1.4 145.1,36.51 144.78,36.83 145,37.05 145,37.88 | U$1.7 150.14,34.61 149.22,34.61 v148.91,34.29
  Top 1.27: C36.1 v142.69,37.65 141.92,38.42 141.92,44.13 146.05,48.26 C2.1 | C2.1 153.67,57.15 C35.+ 153.67,66.04 156.21,68.58 156.21,76.2 153.67,78.74 B1.+ | C39.+ C2.1
  Bottom 0.254: v148.91,34.29 144.78,34.29 142.88,36.2 142.88,37.47 v142.69,37.65
IN2  (via drill 0.61)
  Top 0.254: U$5.1 167.98,38.42 166.69,38.42 166.69,37.97 166.59,37.88 | 166.59,37.88 C50.1 166.87,37.16 U$5.3 | U$5.2 166.66,37.8 166.59,37.88 | U$5.4 166.69,36.51 166.37,36.83 166.59,37.05 166.59,37.88 | U$5.7 171.73,34.61 170.81,34.61 v170.5,34.29
  Top 1.27: C50.1 v164.28,37.65 163.51,38.42 163.51,44.13 167.64,48.26 C47.1 | C47.1 175.26,57.15 C45.+ 175.26,66.04 177.8,68.58 177.8,76.2 175.26,78.74 B3.+ | C38.+ C47.1
  Bottom 0.254: v170.5,34.29 166.37,34.29 164.47,36.2 164.47,37.47 v164.28,37.65
IN3  (via drill 0.61)
  Top 0.254: U$9.1 124.8,38.42 123.51,38.42 123.51,37.97 123.41,37.88 | 123.41,37.88 C64.1 123.69,37.16 U$9.3 | U$9.2 123.48,37.8 123.41,37.88 | U$9.4 123.52,36.51 123.19,36.83 123.41,37.05 123.41,37.88 | U$9.7 128.55,34.61 127.64,34.61 v127.32,34.29
  Top 1.27: C64.1 v121.1,37.65 120.33,38.42 120.33,44.13 124.46,48.26 C61.1 | C61.1 132.08,57.15 C59.+ 132.08,66.04 134.62,68.58 134.62,76.2 132.08,78.74 B5.+ | C40.+ C61.1
  Bottom 0.254: v127.32,34.29 123.19,34.29 121.28,36.2 121.28,37.47 v121.1,37.65
N$1
  Bottom 1.016: Q3.B 20.32,46.99 | 20.32,46.99 15.24,46.99 15.24,52.07 Q14.C | 20.32,46.99 Q1.B Q1.C
N$2
  Bottom 1.016: Q1.E 17.78,53.34 22.86,53.34 D1.K
N$3
  Bottom 1.016: R1.2 Q3.E
N$4
  Top 1.016: D17.C D16.C C25.2
  Bottom 1.016: R16.1 R1.1 D1.A 20.32,62.23 | 34.29,62.23 Q9.2 | D17.C 57.15,67.31 59.69,64.77 63.5,64.77 C26.2 | 20.32,62.23 27.94,62.23 | 27.94,62.23 34.29,62.23 | 20.32,62.23 C23.1 10.16,76.2 D11.C | C31.+ 34.29,62.23 | Q4.C 27.94,71.12 | 27.94,71.12 27.94,62.23 | C30.+ 27.94,71.12 | C25.2 34.29,62.23
N$5
  Bottom 1.016: Q9.1 29.21,57.15 D4.C 26.67,52.07 C7.+ | C7.+ 26.67,44.45 Q3.C | C11.1 C7.+
N$6
  Bottom 1.016: R3.1 D4.A 31.75,52.07 C7.- C11.2
N$7
  Bottom 1.016: Q6.E R3.2
N$8
  Bottom 0.813: Q14.E R2.1
N$9
  Bottom 1.016: D9.A 10.16,43.18 R16.2 11.43,49.53 Q14.B
N$10
  Bottom 1.016: C8.- 81.28,38.1 | D12.C D3.A 66.36,31.75 IC2.3 66.36,38.1 81.28,38.1 | R21.1 81.28,31.75 C15.2 81.28,38.1
N$11
  Bottom 1.016: Q13.E R5.2
N$12
  Bottom 1.016: Q13.B 105.41,50.8 R15.1 106.68,44.45 D8.K
N$13
  Bottom 1.016: Q11.E R6.1
N$14
  Bottom 1.016: R6.2 D6.C 77.47,49.53 85.09,49.53 C13.+ C14.1
N$15
  Bottom 1.016: Q5.1 80.01,52.07 D6.A 90.17,52.07 C13.- 90.17,44.45 | 90.17,44.45 Q10\.C | 90.17,44.45 C14.2
N$16
  Bottom 1.016: 96.52,46.99 Q2.B Q2.C | 96.52,46.99 Q10\.B | Q13.C 101.6,53.34 101.6,46.99 96.52,46.99
N$17
  Top 1.016: Q5.3 85.09,63.5 73.66,63.5 73.66,83.82 83.2,83.82 Q7.B
N$18
  Bottom 1.016: R4.1 Q10\.E
N$19
  Bottom 1.016: Q2.E 99.06,53.34 93.98,53.34 D2.A
N$20  (via drill 3.5)
  other vias: 4,88
N$21
  Top 1.016: Q4.B 24.13,84.07 24.13,80.01 26.67,80.01 26.67,60.96 36.83,60.96 Q9.3
N$22
  Top 1.016: D19.A D18.A C28.1
  Bottom 1.016: C27.1 53.34,69.85 57.15,69.85 59.69,72.39 D18.A | R15.2 R4.2 | R4.2 D2.K | 88.9,62.23 88.9,54.61 82.55,54.61 Q5.2 82.55,67.31 C32.- 71.12,67.31 71.12,72.39 C28.1 | 101.6,62.23 R4.2 | 88.9,62.23 96.52,62.23 | 96.52,62.23 101.6,62.23 | 101.6,62.23 C22.2 105.41,76.2 D10.A | C33.- 96.52,62.23 | 88.9,62.23 Q7.C
N$23
  Top 0.61: C27.2 D18.C
  Top 1.016: D16.A 60.33,62.23 57.78,64.77 57.78,70.48 D18.C
  Bottom 1.016: C25.1 53.34,64.77 57.15,64.77 59.69,62.23 D16.A
  Bottom 1.676: X7.1 66.06,83.84 63.5,81.28 60.96,81.28 58.42,78.74 58.42,73.66 57.15,72.39 D18.C
N$24
  Bottom 1.016: R19.1 50.48,49.53 C5.2 C5.3 IC1.6
N$25
  Bottom 1.016: R22.1 66.36,49.53 C4.3 | C4.2 C4.3 | IC2.6 C4.3
N$26
  Bottom 1.016: Q11.B 63.5,54.61 63.5,49.53 R22.2
N$27
  Bottom 1.016: R19.2 53.34,49.53 53.34,54.61 Q6.B
N$28
  Top 0.813: IC1.2 50.48,35.88 46.35,40.01 46.35,44.13 C5.1
  Top 1.016: C16.- 35.56,15.24 35.56,24.13 R8.1
  Bottom 1.016: IC1.2 50.48,31.75 D13.A D14.C 45.4,24.13 R7.2 R8.1
N$29
  Bottom 1.27: Q12.3 92.08,26.04 R12.2
N$30
  Bottom 1.016: Q8.2 19.05,29.21 17.78,29.21 D5.6 17.78,34.29 26.67,34.29 R20.2 33.02,27.94 R11.1
N$31
  Bottom 1.016: D14.A D13.C IC1.3 53.02,38.1 35.56,38.1 | C9.+ 35.56,38.1 | R20.1 35.56,31.75 C12.2 35.56,38.1
N$32
  Bottom 0.813: D15.K 60.96,17.78 R14.2 60.94,15.22 X5.2
N$33
  Bottom 1.016: D7.4 93.98,35.56 | 93.98,35.56 87.63,35.56 R21.2 | 93.98,35.56 104.14,35.56 104.14,26.04 Q12.1
N$34
  Top 0.813: IC2.2 63.82,35.24 59.69,39.37 59.69,44.13 C4.1
  Top 1.016: C3.+ 81.28,15.24 81.28,24.13 R9.2
  Bottom 1.016: IC2.2 D3.C D12.A 67.31,29.21 67.31,24.13 R10.1 R9.2
N$35
  Bottom 1.27: Q8.3 23.5,26.04 R11.2
N$36
  Top 0.813: R13.1 55.88,6.4 X5.1
  Bottom 0.813: R13.1 55.88,17.78 D15.A
N$37  (via drill 3.5 pad 1.1)
  other vias: 114,4
N$38
  Top 1.016: C26.1 D17.A 59.37,68.9 59.37,75.25 57.15,77.47 D19.C 55.88,78.74 57.15,80.01 64.77,80.01 66.04,78.74 C28.2
  Top 1.676: X6.2 50.82,81.3 50.8,81.28 54.61,77.47 D19.C
N$39  (via drill 3.5)
  other vias: 179,4
N$40  (via drill 3.5)
  other vias: 179,88
N$41  (via drill 3.5 pad 1.1)
  other vias: 114,88
N$42  (via drill 3.5 pad 1.1)
  other vias: 4,4
N$44
  Top 0.254: U$1.10 151.37,37.16 151.76,37.56 151.76,40.63 U$2.3
N$46
  Top 0.254: U$5.10 172.96,37.16 173.35,37.56 173.35,40.63 U$6.3
N$47
  Top 0.254: U$1.6 145.69,35.2 144.55,34.06 R18.2
N$48
  Bottom 1.27: B1.AC2 146.03,78.76 X8.1
N$49
  Bottom 1.27: B1.AC1 154.94,77.47 154.94,83.82 153.67,85.09 151.13,85.09 X8.2
N$50
  Top 0.254: U$5.6 167.28,35.2 166.14,34.06 R26.2
N$51
  Bottom 1.27: B3.AC2 167.62,78.76 X12.1
N$52
  Bottom 1.016: X12.2 172.7,85.07 170.18,82.55 170.18,76.2 B3.AC1
N$57
  Top 0.254: U$9.10 129.78,37.16 130.18,37.56 130.18,40.63 U$10.3
N$58
  Top 0.254: U$9.6 124.11,35.2 122.96,34.06 R30.2
N$59
  Bottom 1.27: B5.AC2 124.44,78.76 X16.1
N$60
  Bottom 1.27: X16.2 129.54,85.09 127,82.55 127,76.2 B5.AC1
OUT1  (via drill 0.4, 0.61)
  Top 0.254: U$1.11 U$1.12 150.74,39.44 v150.5,39.69
  Bottom 1.27: C42.+ 148.59,14.18 C34.+
  other vias: 151.76,44.13 150.5,44.13 153.03,30.8
  pour Top (no thermals): 149.86,39.05 149.86,44.77 152.4,44.77 152.4,39.05
  pour Bottom: 149.86,45.09 152.72,45.09 152.72,35.56 153.99,34.29 153.99,30.16 151.76,30.16 151.76,38.73 149.86,38.73
  pour Top: 152.08,33.97 152.08,31.43 146.37,25.72 146.37,16.83 160.02,16.83 160.02,33.97
SET1
  Top 0.254: U$1.8 152.1,35.85
  pour Top (no thermals): 151.45,36.2 153.35,38.1 158.12,38.1 158.12,34.92 152.08,34.92 151.45,35.56
SET2
  Top 0.254: U$5.8 173.69,35.85
  pour Top (no thermals): 173.04,36.2 174.94,38.1 179.71,38.1 179.71,34.92 173.67,34.92 173.04,35.56
SET3
  Top 0.254: U$9.8 130.51,35.85
  pour Top (no thermals): 129.86,36.2 131.76,38.1 136.53,38.1 136.53,34.92 130.49,34.92 129.86,35.56
SGND1
  pour Top (rank 2, no thermals): 149.86,41.91 146.05,41.91 146.05,45.72 158.12,45.72 158.12,38.42 152.72,38.42 152.72,45.09 149.86,45.09
SGND2
  pour Top (rank 2, no thermals): 171.45,41.91 167.64,41.91 167.64,45.72 179.71,45.72 179.71,38.42 174.31,38.42 174.31,45.09 171.45,45.09
SGND3
  pour Top (rank 2, no thermals): 128.27,41.91 124.46,41.91 124.46,45.72 136.53,45.72 136.53,38.42 131.13,38.42 131.13,45.09 128.27,45.09
V+
  Bottom 0.813: 43.18,20.32 R13.2
  Bottom 1.016: R8.2 C16.+ C18.2 43.18,20.32 54.61,20.32 54.61,26.67 57.47,29.53 57.47,40.64 50.8,40.64 | Q8.1 16.51,17.78 | D11.A 2.54,68.58 | C20.2 50.8,40.64 | IC1.7 50.48,40.96 50.8,40.64
  Bottom 1.676: C16.+ 27.94,20.32 25.4,17.78
  Bottom 1.778: Q4.E 38.1,84.07 C24.1
  Bottom 1.93: X3.1 40.62,3.2 40.64,3.17 | 40.64,3.17 26.67,3.17 25.4,4.45 25.4,6.35 X4.1 25.4,7.64 25.4,17.78 16.51,17.78 C6.+ 2.54,17.78 2.54,68.58 2.54,80.01 10.16,80.01 10.16,88.9 33.66,88.9 33.66,84.34 Q4.E | X2.1 66.02,3.2 66.04,3.17 | 66.04,3.17 80.01,3.17 81.26,4.42 X1.1 | 66.04,3.17 40.64,3.17
V-
  Top 1.016: C19.1 72.39,39.37 71.12,38.1 68.9,38.1 IC2.4
  Top 1.93: X4.3 35.54,4.47 36.83,3.17 50.8,3.17 | 50.8,3.17 76.2,3.17 | 76.2,3.17 89.53,3.17 91.44,5.08 91.44,6.35 X1.3 | X2.3 76.18,3.2 76.2,3.17 | X3.3 50.78,3.2 50.8,3.17
  Bottom 0.813: R14.1 73.66,20.3
  Bottom 1.016: Q12.2 97.79,17.78 | R9.1 C3.- C17.1 77.47,20.32 | D10.C 114.3,68.58 | 77.47,20.32 R12.1 | C19.1 59.05,40.64 59.05,29.53 61.91,26.67 61.91,20.64 62.23,20.32 73.66,20.32 | 77.47,20.32 73.66,20.32 | 73.66,20.3 73.66,20.32
  Bottom 1.676: C3.- 88.9,20.32 91.44,17.78
  Bottom 1.778: C21.2 99.44,84.07 Q7.E
  Bottom 1.93: X1.3 91.44,6.38 91.44,17.78 97.79,17.78 C10.- 114.3,17.78 114.3,68.58 114.3,80.01 94.61,80.01 94.61,83.81 Q7.E

### Text on the board
tPlace: INPUT<14VAC | INPUT<14VAC | AC-IN | AC_IN | AC_IN | AC_IN | 1N4007 | 1N4007 | PNP | NPN | PNP | NPN | NPN | PNP | Rset | Cset | Rset | Cset | Rset | Cset | RED | RED | R_IL | R_IL | R_IL | LED | - | - | - | -
bPlace: Vout Rset / 2.5 24.9k / 3.3 33.2k / 5 49.9k / 12 121k / 15 150k | Vout=LT1021*[1+(R1/R2)] | NPN=KSP42 / PNP=KSP92 / Zener=Vout/2
tNames: 1N4148 | + | G | + | G | + | G | + | G